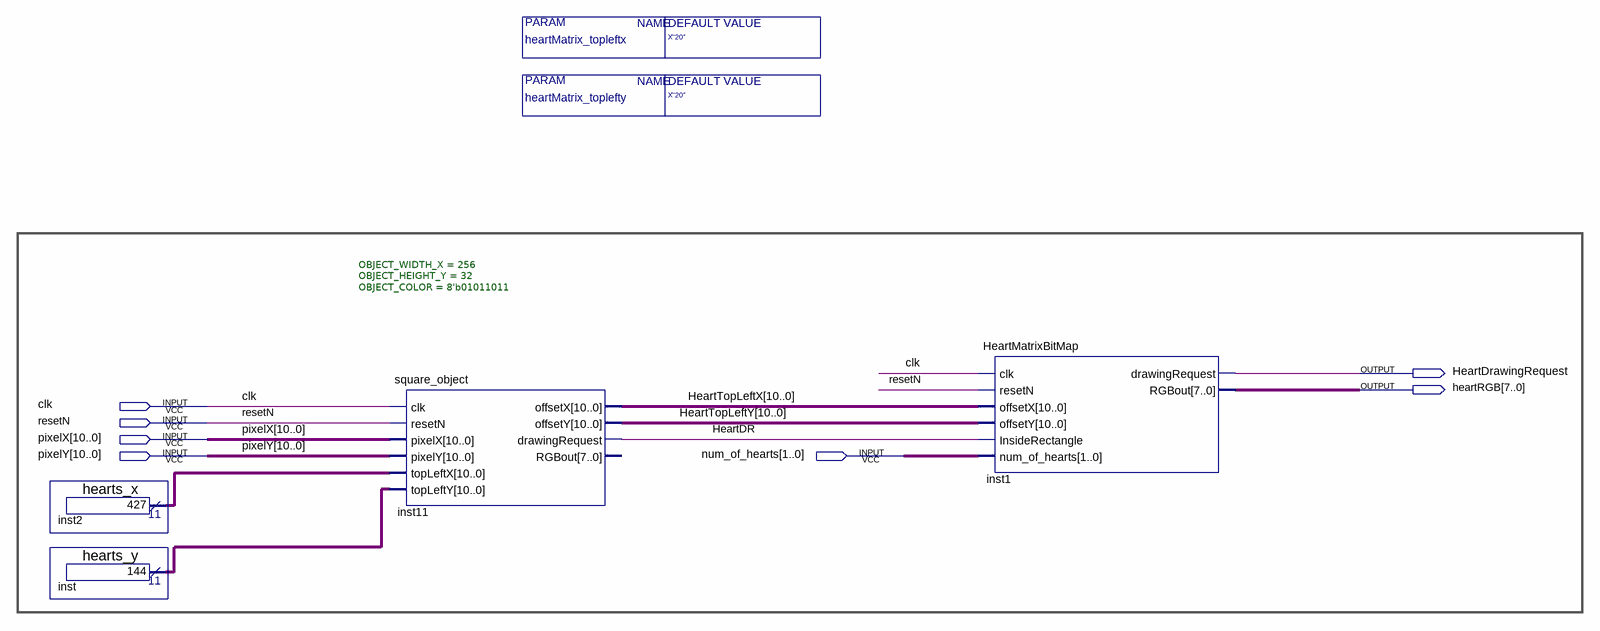
[diagram p0: schematic sheet]
// Quartus schematic HEART_DISPLAY.bdf as structural Verilog: 4 symbols, 7 pins
module HEART_DISPLAY #(parameter heartMatrix_topleftx = "X\"20\"", parameter heartMatrix_toplefty = "X\"20\"") (
  input  clk,
  input  resetN,
  input  [10:0] pixelX,
  input  [10:0] pixelY,
  input  [1:0] num_of_hearts,
  output HeartDrawingRequest,
  output [7:0] heartRGB
);

  wire HeartDR;
  wire [10:0] HeartTopLeftX, HeartTopLeftY, inst2_result, inst_result;

  hearts_x inst2 (.result(inst2_result));
  hearts_y inst (.result(inst_result));
  square_object #(.OBJECT_WIDTH_X(256), .OBJECT_HEIGHT_Y(32), .OBJECT_COLOR(8'b01011011)) inst11 (
    .clk(clk), .resetN(resetN), .pixelX(pixelX), .pixelY(pixelY), .topLeftX(inst2_result),
    .topLeftY(inst_result), .offsetX(HeartTopLeftX), .offsetY(HeartTopLeftY), .drawingRequest(HeartDR));  // open: RGBout
  HeartMatrixBitMap inst1 (
    .clk(clk), .resetN(resetN), .offsetX(HeartTopLeftX), .offsetY(HeartTopLeftY), .InsideRectangle(HeartDR),
    .num_of_hearts(num_of_hearts), .drawingRequest(HeartDrawingRequest), .RGBout(heartRGB));
endmodule
